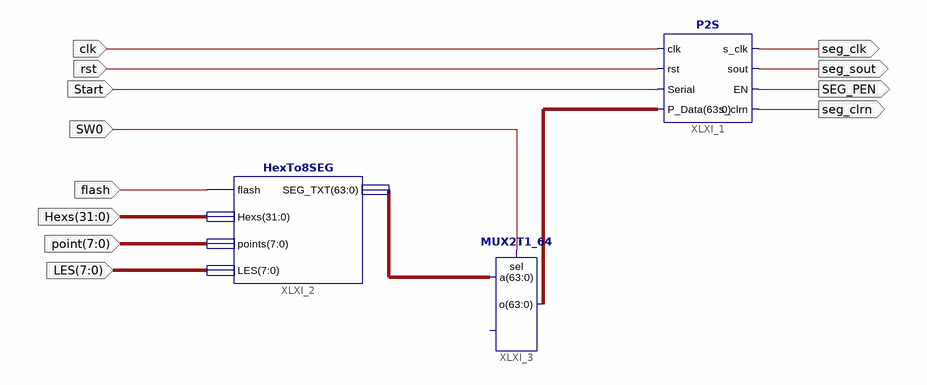
[diagram p0: schematic sheet 1]
// Xilinx ISE schematic Display.sch (kintex7) as structural Verilog: 3 symbols, 12 ports
module Display (
  input  flash,
  input  [31:0] Hexs,
  input  [7:0] point,
  input  [7:0] LES,
  input  clk,
  input  rst,
  input  Start,
  input  SW0,
  output seg_clk,
  output seg_sout,
  output SEG_PEN,
  output seg_clrn
);

  wire [63:0] XLXN_10, XLXN_12;

  P2S XLXI_1 (
    .s_clrn(seg_clrn), .sout(seg_sout), .rst(rst), .EN(SEG_PEN), .Serial(Start), .clk(clk), .s_clk(seg_clk),
    .P_Data(XLXN_12));
  HexTo8SEG XLXI_2 (.flash(flash), .Hexs(Hexs), .points(point), .LES(LES), .SEG_TXT(XLXN_10));
  MUX2T1_64 XLXI_3 (.sel(SW0), .a(XLXN_10), .o(XLXN_12));  // open: b
endmodule
